# Altium project LR1121EVM.PrjPcb
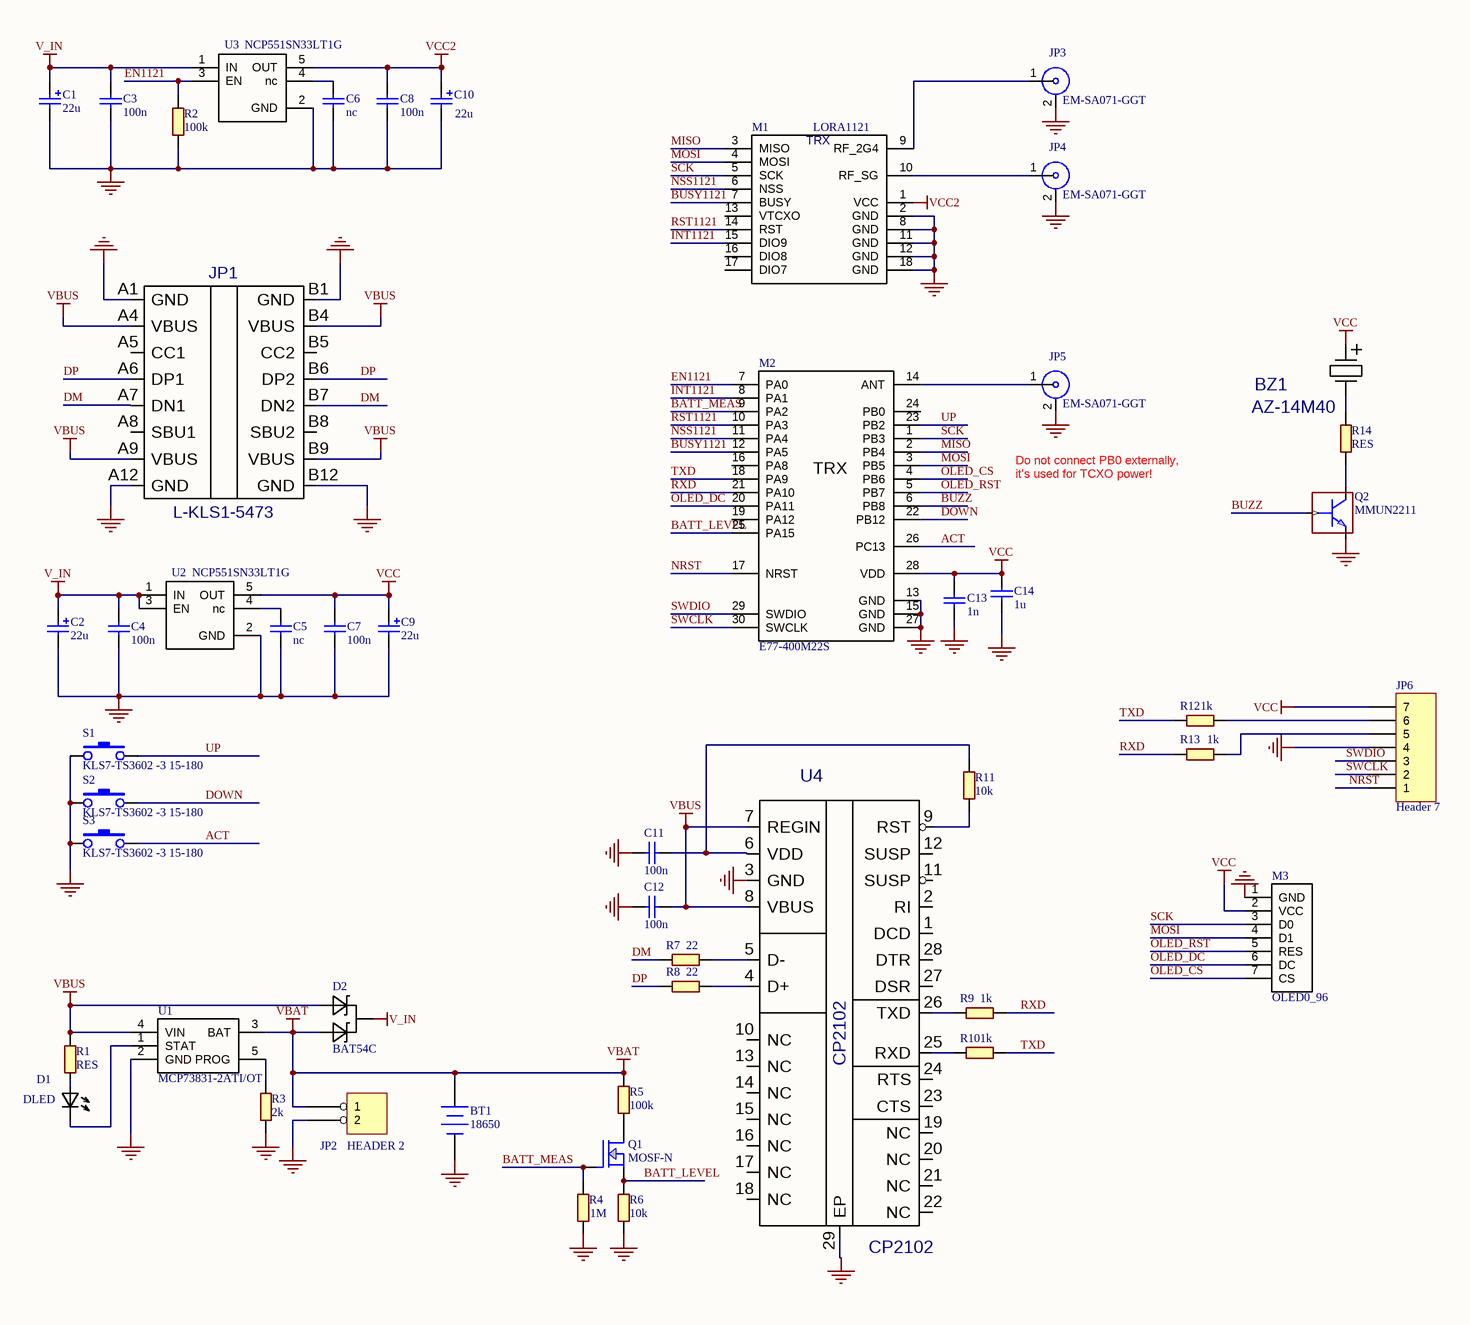
[diagram p0: LR1121EVM.SchDoc]
1 sheet, 50 parts. Net scope: global (net labels, ports and power ports of the same name join across sheets).
Board file: LR1121EVM.PcbDoc

## Sheet LR1121EVM.SchDoc
size 594 x 420 mm; SheetNumber: 1; SheetTotal: 1; SPICEModelCacheXSTIBOJF: <root> / <DocumentId>XSTIBOJF</DocumentId> / </root>

### Parts
BT1  18650  [18650]
BZ1  AZ-14M40  [AZ-14M40]
C1  22u  [C_TANTAL_A]
C2  22u  [C_TANTAL_A]
C3  100n  [C-0603]
C4  100n  [C-0603]
C5  nc  [C-0603]
C6  nc  [C-0603]
C7  100n  [C-0603]
C8  100n  [C-0603]
C9  22u  [C_TANTAL_A]
C10  22u  [C_TANTAL_A]
C11  100n  [C-0603]
C12  100n  [C-0603]
C13  1n  [C-0603]
C14  1u  [C-0603]
D1  DLED  [LED_3mm_RED]
D2  BAT54C  [SOT-23]
JP1  L-KLS1-5473  [L-KLS1-5473]
JP2  HEADER 2  [PLS1-2]
JP3  EM-SA071-GGT  [SMA_F_EDGE]
JP4  EM-SA071-GGT  [SMA_F_EDGE]
JP5  EM-SA071-GGT  [SMA_F_EDGE]
JP6  Header 7  [PLS1-7R]
M1  LORA1121  [LORA1121]
M2  E77-400M22S  [E77XX-M22]
M3  OLED0_96  [OLED096]
Q1  MOSF-N  [SOT-23]
Q2  MMUN2211  [SOT-23]
R1  RES  [R-0603]
R2  100k  [R-0603]
R3  2k  [R-0603]
R4  1M  [R-0603]
R5  100k  [R-0603]
R6  10k  [R-0603]
R7  22  [R-0603]
R8  22  [R-0603]
R9  1k  [R-0603]
R10  1k  [R-0603]
R11  10k  [R-0603]
R12  1k  [R-0603]
R13  1k  [R-0603]
R14  RES  [R-0603]
S1  KLS7-TS3602 -3 15-180  [KLS7-TS3602]
S2  KLS7-TS3602 -3 15-180  [KLS7-TS3602]
S3  KLS7-TS3602 -3 15-180  [KLS7-TS3602]
U1  MCP73831-2ATI/OT  [SOT-23-5]
U2  NCP551SN33LT1G  [SOT-23-5]
U3  NCP551SN33LT1G  [SOT-23-5]
U4  CP2102  [QFN28]

### Nets
GND: BT1.2(-) C1.1 C2.1 C3.2 C4.2 C5.2 C6.2 C7.2 C8.2 C9.1 C10.1 C11.2 C12.1 C13.2 C14.2 JP1.A1(GND) JP1.A12(GND) JP1.B1(GND) JP1.B12(GND) JP2.2 JP3.2 JP4.2 JP5.2 JP6.4 M1.2(GND) M1.8(GND) M1.11(GND) M1.12(GND) M1.18(GND) M2.13(GND) M2.15(GND) M2.27(GND) M3.1(GND) Q2.2(EMITTER) R2.2 R3.1 R4.2 R6.2 S1.1 S2.1 S3.1 U1.2(GND) U2.2(GND) U3.2(GND) U4.3(GND) U4.29(EP)
V_IN: C1.2 C2.2 C3.1 C4.1 D2.3(C1C2) U2.1(IN) U2.3(EN) U3.1(IN)
VBAT: BT1.1(+) D2.1(A1) JP2.1 R5.1 U1.3(BAT)
VBUS: C12.2 D2.2(A2) JP1.A4(VBUS) JP1.A9(VBUS) JP1.B4(VBUS) JP1.B9(VBUS) R1.1 U1.4(VIN) U4.7(REGIN) U4.8(VBUS)
VCC: BZ1.1 C7.1 C9.2 C13.1 C14.1 JP6.7 M2.28(VDD) M3.2(VCC) U2.5(OUT)
VCC2: C8.1 C10.2 M1.1(VCC) U3.5(OUT)
\: M2.26(PC13) S3.2  [also labelled ACT]
BATT_LEVEL: M2.25(PA15) Q1.2(SOURCE) R6.1
BATT_MEAS: M2.9(PA2) Q1.1(GATE) R4.1
BUSY1121: M1.7(BUSY) M2.12(PA5)
BUZZ: M2.6(PB8) Q2.1(BASE)
DM: JP1.A7(DN1) JP1.B7(DN2) R7.2
DOWN: M2.22(PB12) S2.2
DP: JP1.A6(DP1) JP1.B6(DP2) R8.2
EN1121: M2.7(PA0) R2.1 U3.3(EN)
INT1121: M1.15(DIO9) M2.8(PA1)
MISO: M1.3(MISO) M2.2(PB4)
MOSI: M1.4(MOSI) M2.3(PB5) M3.4(D1)
NRST: JP6.1 M2.17(NRST)
NSS1121: M1.6(NSS) M2.11(PA4)
OLED_CS: M2.4(PB6) M3.7(CS)
OLED_DC: M2.20(PA11) M3.6(DC)
OLED_RST: M2.5(PB7) M3.5(RES)
RST1121: M1.14(RST) M2.10(PA3)
RXD: M2.21(PA10) R9.1 R13.2
SCK: M1.5(SCK) M2.1(PB3) M3.3(D0)
SWCLK: JP6.2 M2.30(SWCLK)
SWDIO: JP6.3 M2.29(SWDIO)
TXD: M2.18(PA9) R10.1 R12.2
UP: M2.23(PB2) S1.2
NetBZ1_2: BZ1.2 R14.1
NetC5_1: C5.1 U2.4(nc)
NetC6_1: C6.1 U3.4(nc)
NetC11_1: C11.1 R11.1 U4.6(VDD)
NetD1_1: D1.1 R1.2
NetD1_2: D1.2 U1.1(STAT)
NetJP3_1: JP3.1 M1.9(RF_2G4)
NetJP4_1: JP4.1 M1.10(RF_SG)
NetJP5_1: JP5.1 M2.14(ANT)
NetJP6_5: JP6.5 R13.1
NetJP6_6: JP6.6 R12.1
NetQ1_3: Q1.3(DRAIN) R5.2
NetQ2_3: Q2.3(COLLECTOR) R14.2
NetR3_2: R3.2 U1.5(PROG)
NetR7_1: R7.1 U4.5(D-)
NetR8_1: R8.1 U4.4(D+)
NetR9_2: R9.2 U4.26(TXD)
NetR10_2: R10.2 U4.25(RXD)
NetR11_2: R11.2 U4.9(RST)

Not connected (* = marked no-connect by the designer): JP1 17(VSS) A5(CC1) A8(SBU1) B5(CC2) B8(SBU2); M1 13(VTCXO) 16(DIO8) 17(DIO7); M2 16(PA8) 19(PA12) 24(PB0); U4 1(DCD) 2(RI) 10(NC) 11(SUSP) 12(SUSP) 13(NC) 14(NC) 15(NC) 16(NC) 17(NC) 18(NC) 19(NC) 20(NC) 21(NC) 22(NC) 23(CTS) 24(RTS) 27(DSR) 28(DTR)

### Notes on the sheet
- Do not connect PB0 externally,
  it's used for TCXO power!
- DWG NO:
- REV:
- THIS DOCUMENT AND THE DATA DISCLOSED HEREIN OR
- HEREWITH IS THE PROPERTY OF ALTIUM LIMITED AND MAY
- BE FREELY DISTRIBUTED IN WHOLE. NO RIGHTS ARE
- RESERVED OR EXPRESS OR IMPLIED WARANTEE GIVEN.
- REVISION
- DESCRIPTION
- DATE
- APPROVED
- ENG:
- APPROVALS
- PROJECT
- DSN:
- CHK:
- REFERENCE DOCUMENTS
- PROJECT REVISION:
- TITLE
- DOCUMENT REVISION:
- DESIGN ITEM:
- BOM:
- FAB DWG:
- PCB DWG:
- ASSY DWG:
- SCALE:
- A2
- SIZE
- CAGE CODE
- FILE NAME
- DWG NO.
- SHEET
- OF
- REV
- (in symbol E77-400M22S) TRX
- (in symbol LORA1121) TRX

### Library data of the parts
BT1 = Battery: Multicell Battery; Published: 24-Mar-1999; LatestRevisionDate: 17-Jul-2002; LatestRevisionNote: Re-released for DXP Platform.; PackageReference: BAT-2; Publisher: Altium Limited; PackageDescription: Battery; 2 Leads; Value: 18650
BZ1 = BUZ-AZ-14M40: Value: {Value}; Mounting  Method: THT
C1 C2 C9 C10 = CAPP: Voltage: 16V; Вид: Конденсатор
C3-C8 C11-C14 = CAPN: Voltage: 50V; Точність/група: NP0; Вид: Конденсатор
D1 = DLED: Вид: Світлодіод
D2 = BAT54C: Вид: Діод
JP1 = L-KLS1-5473: Mounting  Method: SMD; Value: *
JP2 = HEADER 2: Вид: Роз'єм; *: *
JP3-JP5 = SMA: SMA Female R/A PCB Mount; Вид: Роз'єм
JP6 = Header 7: Header, 7-Pin; LatestRevisionDate: 17-Jul-2002; LatestRevisionNote: Re-released for DXP Platform.; Publisher: Altium Limited
Q1 = MOSF-N: Вид: Транзистор
Q2 = MMUN2211: Вид: Транзистор
R1-R14 = RES: Точність/група: 5%; Вид: Резистор
S1-S3 = SW-1: Вид: Кнопка; Робоча напруга: *
U1 = MCP73831
U2 U3 = LP2980: 50mA Low-Dropout Regulator; Вид: Мікросхема
U4 = CP2102: Value: {Value}; Mounting  Method: SMD